# EAGLE design atv_sheild1 (EAGLE 7.6.0)
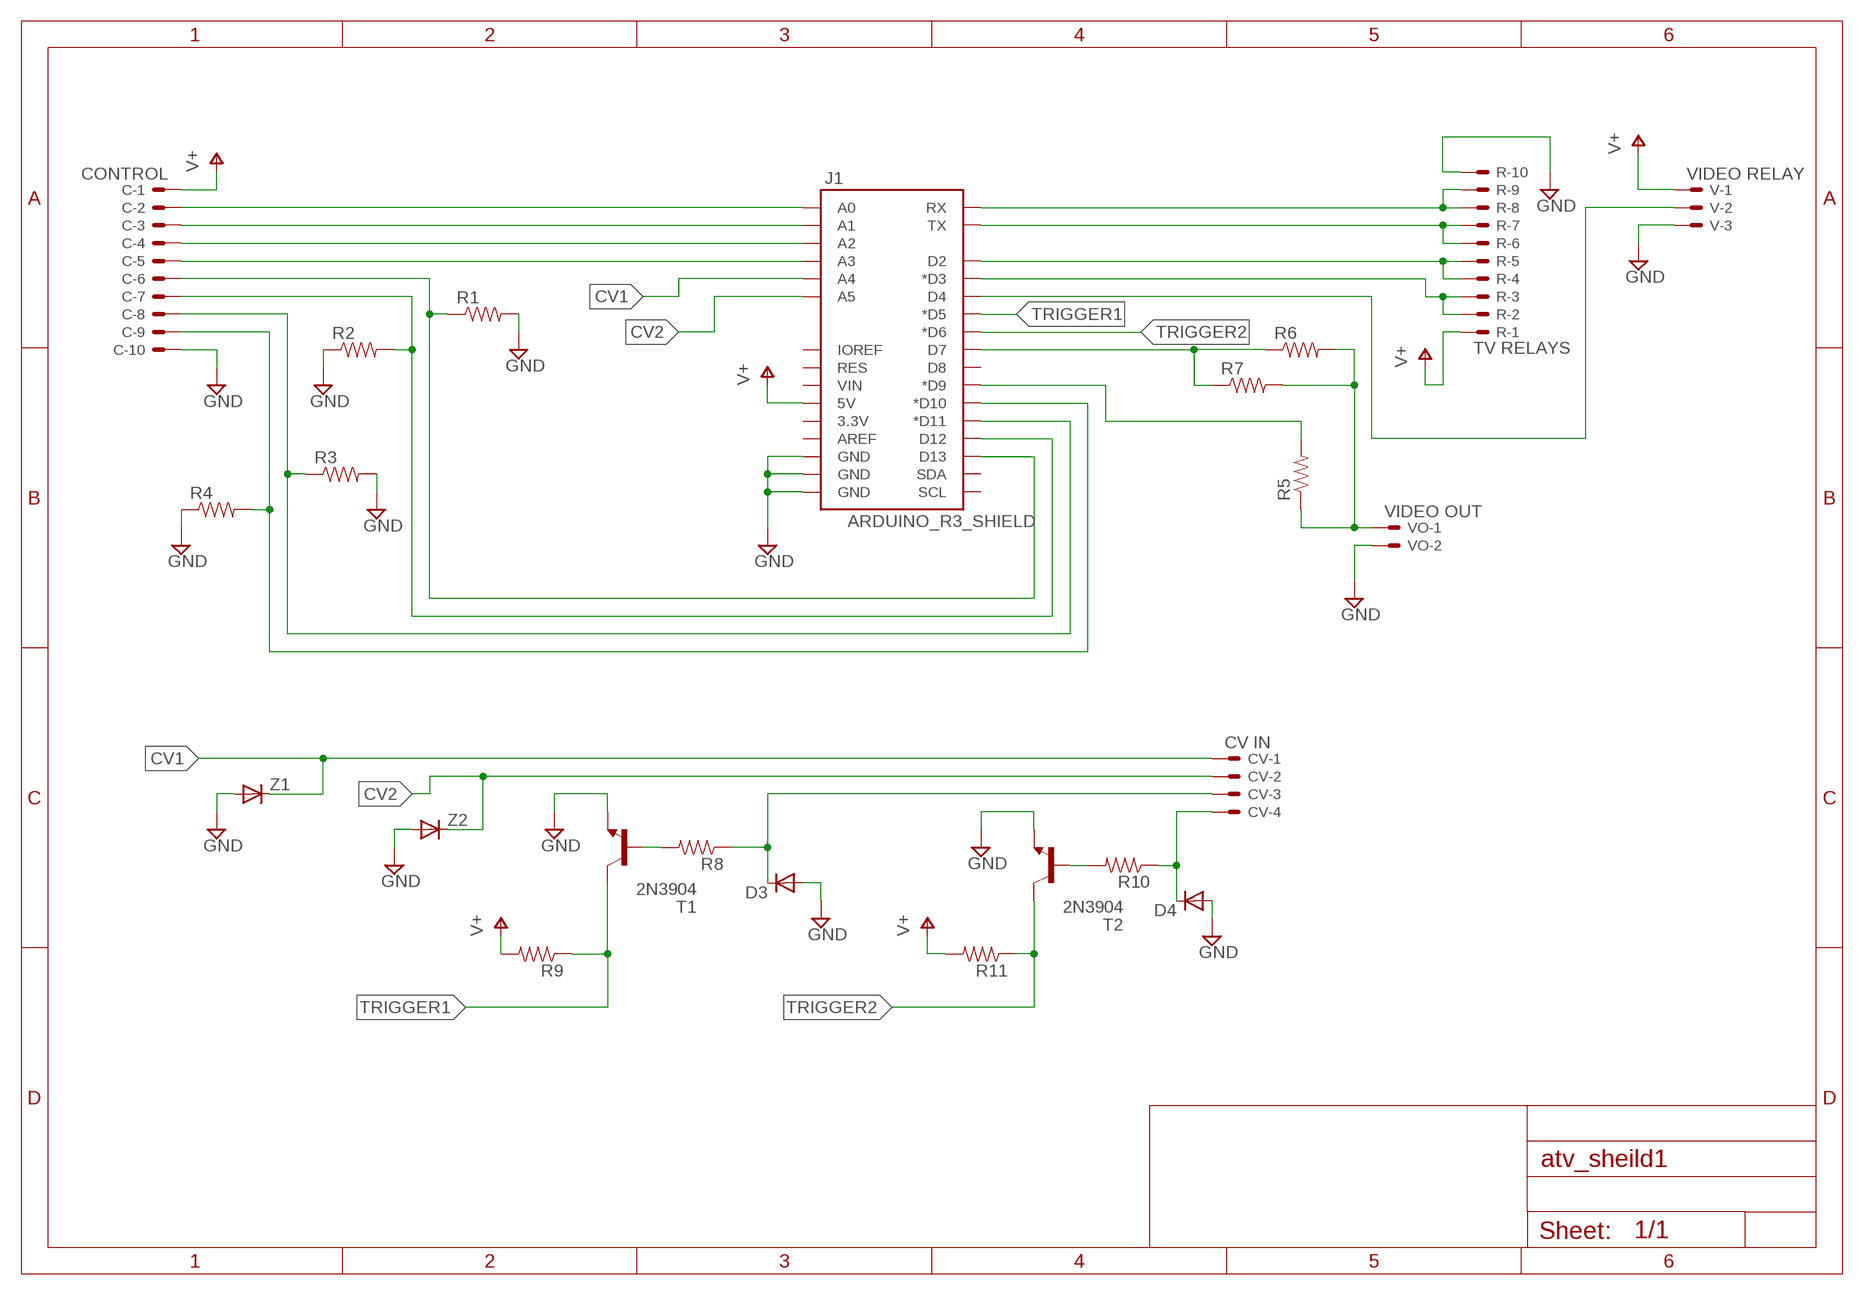
[diagram p0: schematic, sheet 1]

## Parts
C  CONTROL  22-23-2101  [22-23-2101]
CV  CV IN  22-23-2041  [22-23-2041]
D3  SMALL_DIODEDO35-7  [DO35-7]
D4  SMALL_DIODEDO35-7  [DO35-7]
J1  ARDUINO_R3_SHIELD  [UNO_R3_SHIELD]
R  TV RELAYS  22-23-2101  [22-23-2101]
R1  RESISTORPTH-1/4W  [AXIAL-0.4]
R2  RESISTORPTH-1/4W  [AXIAL-0.4]
R3  RESISTORPTH-1/4W  [AXIAL-0.4]
R4  RESISTORPTH-1/4W  [AXIAL-0.4]
R5  RESISTORPTH-1/4W  [AXIAL-0.4]
R6  RESISTORPTH-1/4W  [AXIAL-0.4]
R7  RESISTORPTH-1/4W  [AXIAL-0.4]
R8  RESISTORPTH-1/4W  [AXIAL-0.4]
R9  RESISTORPTH-1/4W  [AXIAL-0.4]
R10  RESISTORPTH-1/4W  [AXIAL-0.4]
R11  RESISTORPTH-1/4W  [AXIAL-0.4]
T1  2N3904  [TO92]
T2  2N3904  [TO92]
V  VIDEO RELAY  22-23-2031  [22-23-2031]
VO  VIDEO OUT  22-23-2021  [22-23-2021]
Z1  SMALL_DIODEDO35-7  [DO35-7]
Z2  SMALL_DIODEDO35-7  [DO35-7]

## Nets
CV1: CV.1 J1.A4 Z1.C
CV2: CV.2 J1.A5 Z2.C
GND: C.10 D3.A D4.A J1.GND@0(GND) J1.GND@1(GND) J1.GND@2(GND) R1.P$2 R2.P$1 R3.P$2 R4.P$1 R.10 T1.3(E) T2.3(E) V.3 VO.2 Z1.A Z2.A
N$2: J1.TX R.6 R.7
N$3: J1.D2 R.4 R.5
N$4: J1.D3(*D3) R.2 R.3
N$6: J1.D4 V.2
N$7: C.5 J1.A3
N$8: C.2 J1.A0
N$9: C.3 J1.A1
N$10: C.4 J1.A2
N$11: C.6 J1.D13 R1.P$1
N$12: C.7 J1.D12 R2.P$2
N$13: C.8 J1.D11(*D11) R3.P$1
N$14: C.9 J1.D10(*D10) R4.P$2
N$15: CV.3 D3.C R8.P$1
N$16: R5.P$1 R6.P$2 R7.P$2 VO.1
N$17: J1.D7 R6.P$1 R7.P$1
N$18: J1.D9(*D9) R5.P$2
N$20: R8.P$2 T1.2(B)
N$21: CV.4 D4.C R10.P$1
N$22: J1.RX R.8 R.9
N$23: R10.P$2 T2.2(B)
TRIGGER1: J1.D5(*D5) R9.P$1 T1.1(C)
TRIGGER2: J1.D6(*D6) R11.P$1 T2.1(C)
V+: C.1 J1.5V R9.P$2 R11.P$2 R.1 V.1
Unconnected: J1.3.3V J1.AREF J1.D8 J1.IOREF J1.RES J1.SCL J1.SDA J1.VIN

## Library data of the parts
C R = con-molex:22-23-2101: .100" (2.54mm) Center Header - 10 Pin; MF: MOLEX; MPN: 22-23-2101; OC_FARNELL: 1756828; OC_NEWARK: 94C0765
CV = con-molex:22-23-2041: .100" (2.54mm) Center Header - 4 Pin; MF: MOLEX; MPN: 22-23-2041; OC_FARNELL: 1462920; OC_NEWARK: 38C0355
D3 D4 Z1 Z2 = MusicThingModular:SMALL_DIODE: Small Signal Diode
J1 = SparkFun-Boards:ARDUINO_R3_SHIELD: Shield form compatible with the Arduino Uno R3.
R1-R11 = SparkFun-Passives:RESISTOR: Resistor Basic schematic elements and footprints for 0603, 1206, and PTH resistors.
T1 T2 = transistor:2N3904: NPN TRANSISTOR
V = con-molex:22-23-2031: .100" (2.54mm) Center Header - 3 Pin; MF: MOLEX; MPN: 22-23-2031; OC_FARNELL: 1462950; OC_NEWARK: 30C0862
VO = con-molex:22-23-2021: .100" (2.54mm) Center Header - 2 Pin; MF: MOLEX; MPN: 22-23-2021; OC_FARNELL: 1462926; OC_NEWARK: 25C3832

## Board
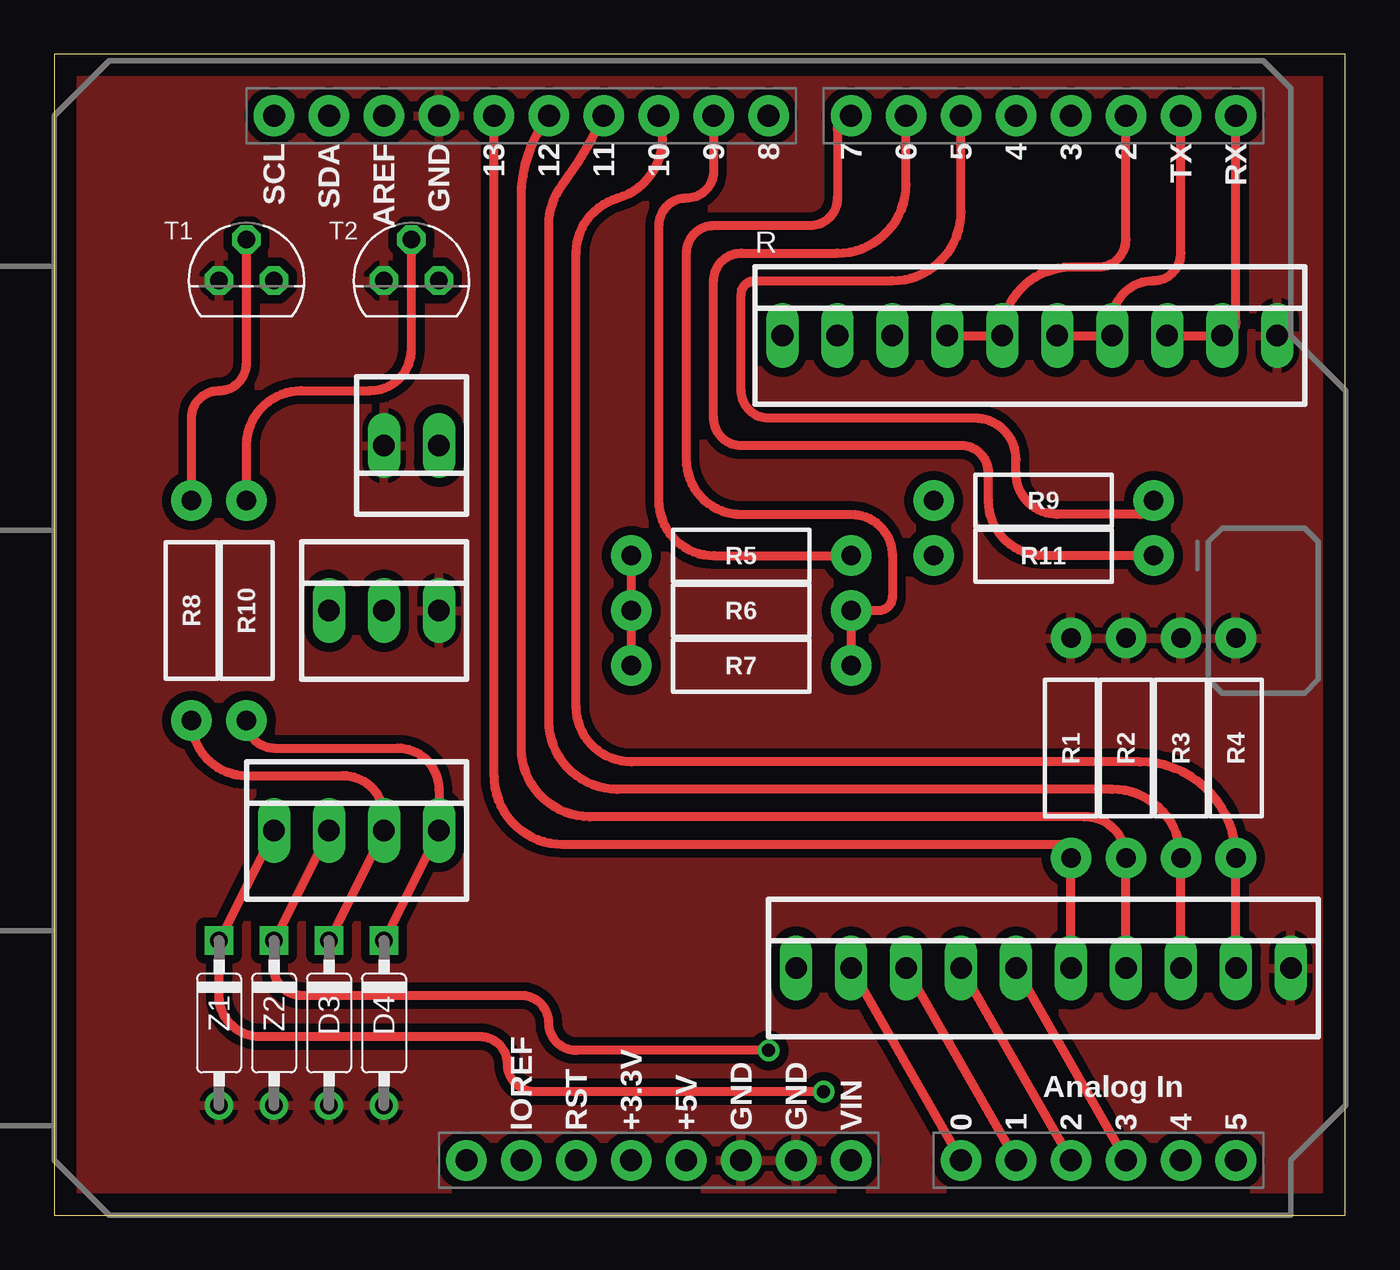
[diagram p1: board, top side]
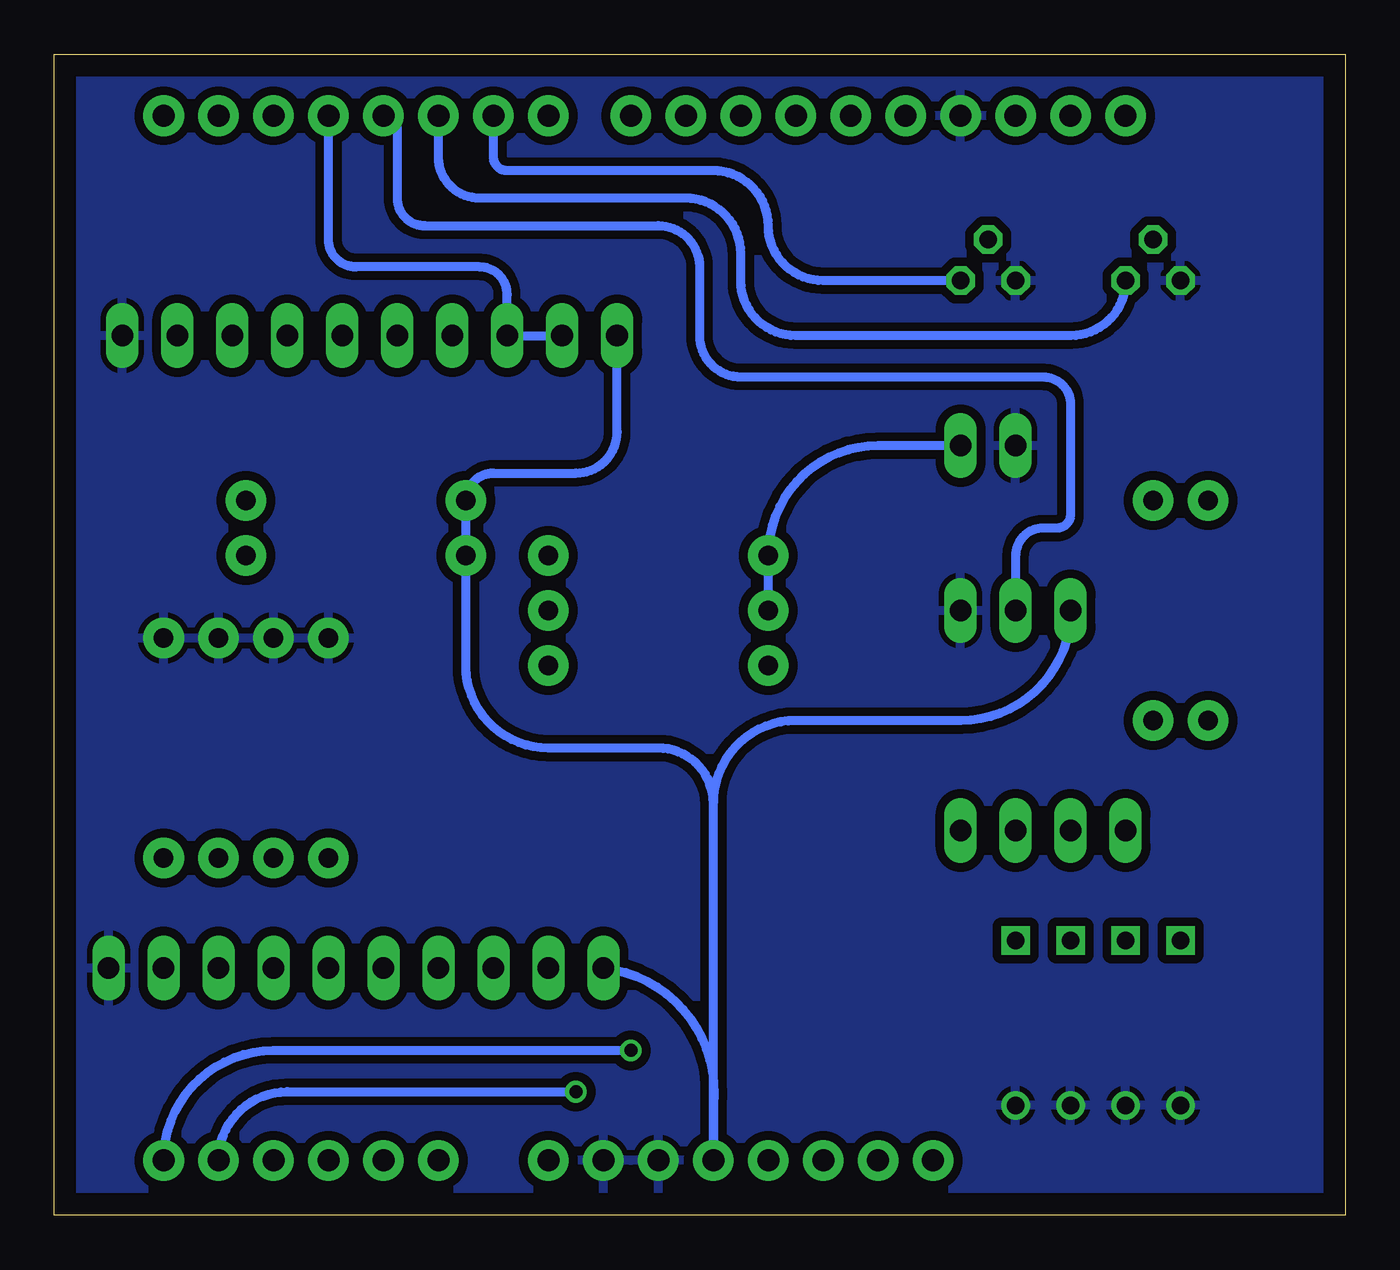
[diagram p2: board, bottom side, seen from below]

Size 59.67 x 53.65 mm. Coordinates in mm from the lower left corner, seen from the top.
Outline: 0,0 59.67,0 59.67,53.65 0,53.65 0,0
Copper layers (1*16): Top 0.035mm / dielectric 1.5mm / Bottom 0.035mm
Design rules "default": minimum track width 10mil, minimum drill 24mil, track to track 8mil, track to pad 8mil, pad to pad 8mil, via to via 8mil, smd to smd 8mil, copper to edge 40mil, drill to drill 8mil, minimum pad ring 10mil, minimum via ring 8mil, stop-mask expansion 4mil, vias tented up to drill 0mil, thermal gap 10mil

### Footprints (pad centres in the part's own frame; a part is rotated, then mirrored left to right if it is on the bottom)
22-23-2101 = drill 1 long: 1 -11.43,0; 2 -8.89,0; 3 -6.35,0; 4 -3.81,0; 5 -1.27,0; 6 1.27,0; 7 3.81,0; 8 6.35,0; 9 8.89,0; 10 11.43,0
22-23-2041 = drill 1 long: 1 -3.81,0; 2 -1.27,0; 3 1.27,0; 4 3.81,0
DO35-7 = drill 0.813: A 3.81,0 | drill 0.813 square: C -3.81,0
UNO_R3_SHIELD = drill 1.016 pad 1.88: 3.3V 50.8,26.67; 5V 50.8,29.21; A0 50.8,41.91; A1 50.8,44.45; A2 50.8,46.99; A3 50.8,49.53; A4 50.8,52.07; A5 50.8,54.61; AREF 2.54,15.24; D2 2.54,49.53; D3 2.54,46.99; D4 2.54,44.45; D5 2.54,41.91; D6 2.54,39.37; D7 2.54,36.83; D8 2.54,33.02; D9 2.54,30.48; D10 2.54,27.94; D11 2.54,25.4; D12 2.54,22.86; D13 2.54,20.32; GND@0 50.8,31.75; GND@1 50.8,34.29; GND@2 2.54,17.78; IOREF 50.8,21.59; NC 50.8,19.05; RES 50.8,24.13; RX 2.54,54.61; SCL 2.54,10.16; SDA 2.54,12.7; TX 2.54,52.07; VIN 50.8,36.83
AXIAL-0.4 = drill 0.9 pad 1.88: P$1 -5.08,0; P$2 5.08,0
TO92 = drill 0.813 octagon: 1 1.27,0; 2 0,1.905; 3 -1.27,0
22-23-2031 = drill 1 long: 1 -2.54,0; 2 0,0; 3 2.54,0
22-23-2021 = drill 1 long: 1 -1.27,0; 2 1.27,0

### Placement (x,y rotation side)
C  45.72,11.43 0 top
CV  13.97,17.78 0 top
D3  12.7,8.89 270 top
D4  15.24,8.89 270 top
J1  0,53.34 270 top
R  45.09,40.64 0 top
R1  46.99,21.59 90 top
R2  49.53,21.59 270 top
R3  52.07,21.59 90 top
R4  54.61,21.59 270 top
R5  31.75,30.48 0 top
R6  31.75,27.94 180 top
R7  31.75,25.4 180 top
R8  6.35,27.94 90 top
R9  45.72,33.02 180 top
R10  8.89,27.94 90 top
R11  45.72,30.48 180 top
T1  8.89,43.18 0 top
T2  16.51,43.18 0 top
V  15.24,27.94 0 top
VO  16.51,35.56 180 top
Z1  7.62,8.89 270 top
Z2  10.16,8.89 270 top

### Tracks (layer width: path | path; a pad name or v marks a point on that pad's centre or on a via)
CV1  (via drill 0.6)
  Top 0.406: CV.1 Z1.C 7.62,10.16 arc90 9.53,8.26 19.68,8.26 arc-90 20.95,6.99 arc90 22.23,5.71 v35.56,5.71
  Bottom 0.406: J1.A4 arc90 48.9,5.71 v35.56,5.71
CV2  (via drill 0.6)
  Top 0.406: CV.2 Z2.C 10.16,11.43 arc90 11.43,10.16 21.59,10.16 arc-90 22.86,8.89 arc90 24.13,7.62 v33.02,7.62
  Bottom 0.406: J1.A5 arc90 49.53,7.62 v33.02,7.62
GND
  pour Top (isolate 0.406): 0,53.34 59.69,53.34 59.69,0 0,0
  pour Bottom (isolate 0.406): 0,53.34 59.69,53.34 59.69,0 0,0
N$2
  Top 0.406: R.6 R.7 48.9,41.27 arc-90 50.8,43.18 arc90 52.07,44.45 J1.TX
N$3
  Top 0.406: R.4 R.5 arc-90 46.99,43.81 48.26,43.81 arc90 49.53,45.09 J1.D2
N$4
  Bottom 0.406: R.2 R.3 38.73,42.55 arc-90 40.01,43.81 45.72,43.81 arc90 46.99,45.09 J1.D3
N$6
  Bottom 0.406: J1.D4 arc90 43.81,50.16 43.81,46.99 arc-90 42.55,45.72 31.75,45.72 arc90 29.84,43.81 29.84,40.64 arc-90 27.94,38.73 13.97,38.73 arc90 12.7,37.47 12.7,32.38 arc90 13.34,31.75 13.97,31.75 arc-90 15.24,30.48 V.2
N$7
  Top 0.406: C.5 J1.A3
N$8
  Top 0.406: C.2 J1.A0
N$9
  Top 0.406: C.3 J1.A1
N$10
  Top 0.406: C.4 J1.A2
N$11
  Top 0.406: C.6 R1.P$1 arc90 46.35,17.14 23.5,17.14 arc-90 20.32,20.32 J1.D13
N$12
  Top 0.406: C.7 R2.P$2 arc90 47.62,18.41 24.77,18.41 arc-90 21.59,21.59 21.59,46.99 arc-37 J1.D12
N$13
  Top 0.406: C.8 R3.P$1 arc90 48.9,19.68 26.04,19.68 arc-90 22.86,22.86 22.86,45.72 arc-37 23.5,47.62 arc12 J1.D11
N$14
  Top 0.406: C.9 R4.P$2 arc90 50.16,20.95 26.67,20.95 arc-90 24.13,23.5 24.13,44.45 arc-74 26.04,46.99 arc94 J1.D10
N$15
  Top 0.406: D3.C CV.3 15.24,18.41 arc90 13.34,20.32 8.89,20.32 arc-90 R8.P$1
N$16
  Top 0.406: R5.P$1 R7.P$2
  Bottom 0.406: R6.P$2 R5.P$1 arc90 21.59,35.56 VO.1
N$17
  Top 0.406: J1.D7 arc90 36.2,50.16 36.2,46.99 arc-90 34.92,45.72 30.48,45.72 arc90 29.21,44.45 29.21,34.92 arc90 31.75,32.38 36.83,32.38 arc-90 38.73,30.48 38.73,28.57 arc-90 38.1,27.94 R6.P$1 R7.P$1
N$18
  Top 0.406: J1.D9 30.48,48.26 arc-90 29.21,46.99 arc90 27.94,45.72 27.94,33.02 arc90 30.48,30.48 R5.P$2
N$20
  Top 0.406: R8.P$2 6.35,36.83 arc-90 7.62,38.1 arc90 8.89,39.37 T1.2
N$21
  Top 0.406: D4.C CV.4 17.78,19.68 arc90 15.88,21.59 10.16,21.59 arc-90 R10.P$1
N$22
  Top 0.406: R.8 R.9 arc90 54.61,41.27 J1.RX
N$23
  Top 0.406: R10.P$2 8.89,35.56 arc-90 11.43,38.1 14.61,38.1 arc90 16.51,40.01 T2.2
TRIGGER1
  Top 0.406: R9.P$1 arc-90 50.16,32.38 46.35,32.38 arc-90 44.45,34.29 44.45,34.92 arc90 42.55,36.83 33.02,36.83 arc-90 31.75,38.1 31.75,42.55 arc-90 32.38,43.18 38.73,43.18 arc90 41.91,46.35 J1.D5
  Bottom 0.406: T1.1 arc90 12.7,40.64 25.4,40.64 arc90 27.94,43.18 27.94,44.45 arc-90 30.48,46.99 40.01,46.99 arc90 41.91,48.9 J1.D5
TRIGGER2
  Top 0.406: R11.P$1 45.72,30.48 arc-90 43.18,33.02 43.18,34.29 arc90 41.91,35.56 31.75,35.56 arc-90 30.48,36.83 30.48,43.18 arc-90 31.75,44.45 36.2,44.45 arc90 39.37,47.62 J1.D6
  Bottom 0.406: T2.1 24.13,43.18 arc90 26.67,45.72 arc-90 29.21,48.26 38.73,48.26 arc90 39.37,48.9 J1.D6
V+
  Bottom 0.406: 29.21,19.05 J1.5V 29.21,5.08 arc-90 C.1 | V.1 arc90 17.78,22.86 25.4,22.86 arc-90 29.21,19.05 | 29.21,19.05 arc-90 31.75,21.59 36.83,21.59 arc90 40.64,25.4 R11.P$2 R9.P$2 arc90 39.37,34.29 35.56,34.29 arc-90 33.66,36.2 R.1